# EAGLE design attiny_breakout_ISP6 (EAGLE 6.5.0)
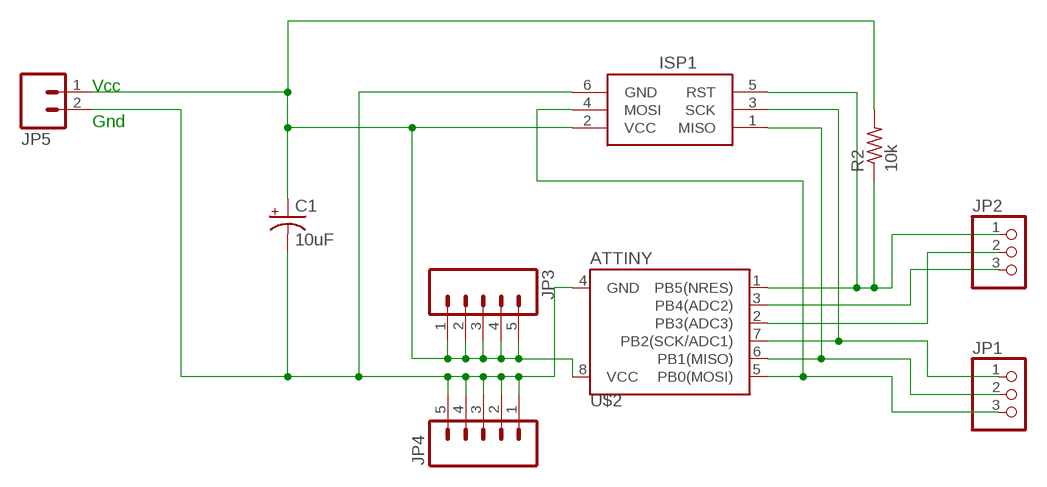
[diagram p0: schematic, sheet 1]

## Parts
C1  10uF  CAP_POLPTH2  [CPOL-RADIAL-10UF-25V]
ISP1  AVRISP-6  [AVRISP]
JP1  PINHD-1X3  [1X03]
JP2  PINHD-1X3  [1X03]
JP3  M05PTH  [1X05]
JP4  M05PTH  [1X05]
JP5  M02PTH  [1X02]
R2  10k  R-US_0207/12  [0207/12]
U$2  ATTINY  ATTINY13DIP  [DIP08]

## Nets
N$1: ISP1.4(MOSI) JP1.3 U$2.5(PB0(MOSI))
N$2: ISP1.1(MISO) JP1.2 U$2.6(PB1(MISO))
N$3: ISP1.5(RST) JP2.1 R2.1 U$2.1(PB5(NRES))
N$4: ISP1.3(SCK) JP1.1 U$2.7(PB2(SCK/ADC1))
N$5: JP2.2 U$2.2(PB3(ADC3))
N$6: JP2.3 U$2.3(PB4(ADC2))
N$7: C1.2(-) ISP1.6(GND) JP4.1 JP4.2 JP4.3 JP4.4 JP4.5 JP5.2 U$2.4(GND)
N$9: C1.1(+) ISP1.2(VCC) JP3.1 JP3.2 JP3.3 JP3.4 JP3.5 JP5.1 R2.2 U$2.8(VCC)

## Notes on the sheet
- Vcc
- Gnd

## Library data of the parts
C1 = SparkFun-Capacitors:CAP_POL: Capacitor Polarized These are standard SMD and PTH capacitors. Normally 10uF, 47uF, and 100uF in electrolytic and tantalum varieties. Always verify the external diameter of the through hole cap, it varies with capacity, voltage, and manufacturer. The EIA devices should be standard.
ISP1 = adafruit:AVRISP: AVR ISP HEADER Standard 6 pin header for AVR programming
JP1 JP2 = adafruit:PINHD-1X3: PIN HEADER
JP3 JP4 = SparkFun-Connectors:M05: Header 5 Standard 5-pin 0.1" header. Use with straight break away headers (SKU : PRT-00116), right angle break away headers (PRT-00553), swiss pins (PRT-00743), machine pins (PRT-00117), and female headers (PRT-00115). Molex polarized connector foot print use with SKU : PRT-08230 with associated crimp pins and housings.
JP5 = SparkFun-Connectors:M02: Standard 2-pin 0.1" header. Use with - straight break away headers ( PRT-00116) - right angle break away headers (PRT-00553) - swiss pins (PRT-00743) - machine pins (PRT-00117) - female headers (PRT-00115) Molex polarized connector foot print use with: PRT-08233 with associated crimp pins and housings. 2.54_SCREWTERM for use with PRT-10571. 3.5mm Screw Terminal footprints for PRT-08084 5mm Screw Terminal footprints for use with PRT-08433
R2 = adafruit:R-US_: RESISTOR, American symbol
U$2 = SparkFun-DigitalIC:ATTINY13: Atmel 8-pin 1kB flash uC

## Board
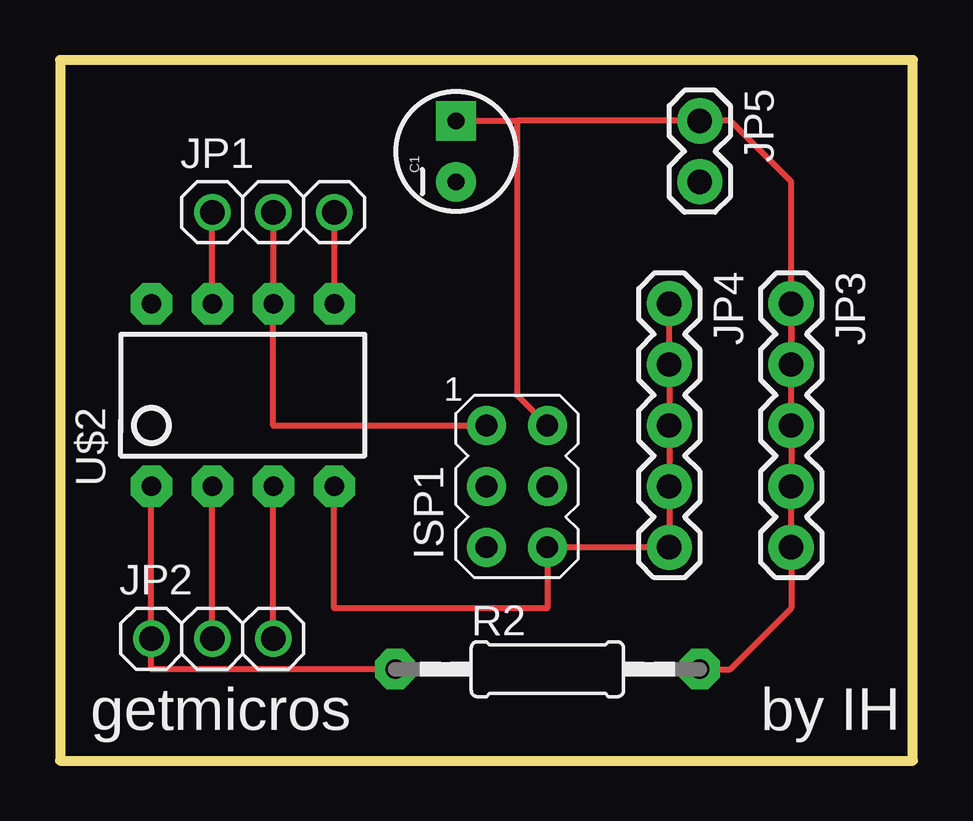
[diagram p1: board, top side]
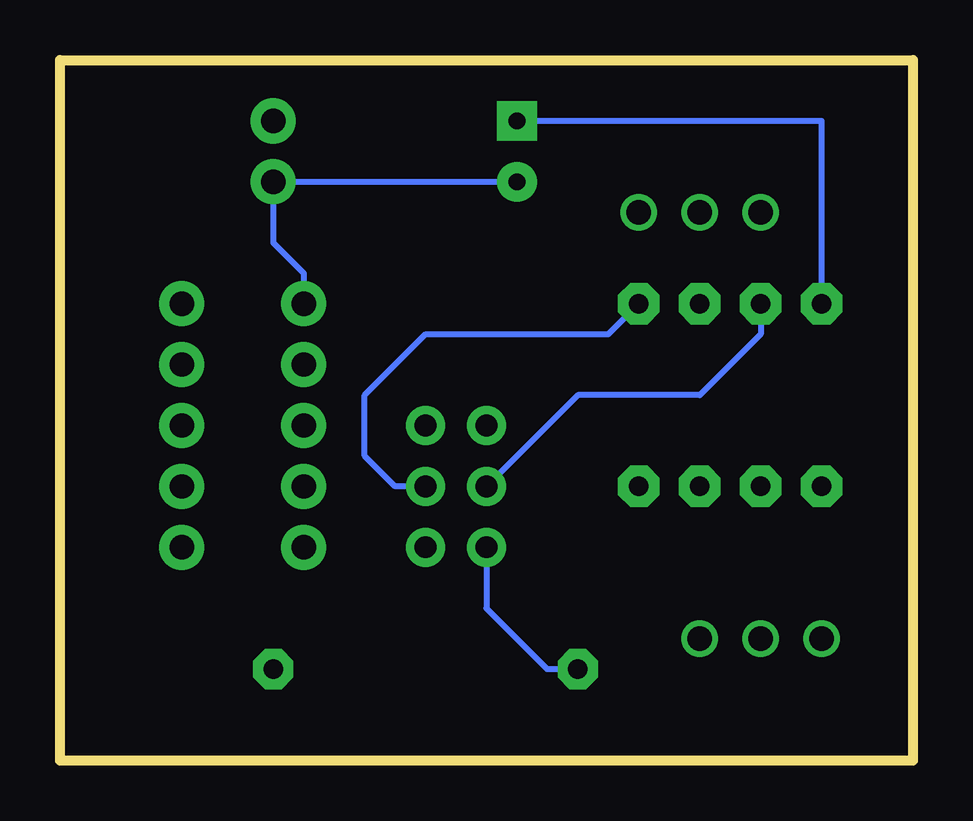
[diagram p2: board, bottom side, seen from below]

Size 35.56 x 29.21 mm. Coordinates in mm from the lower left corner, seen from the top.
Outline: 0,29.21 0,0 35.56,0 35.56,29.21 0,29.21
Copper layers (1*16): Top 0.0356mm / dielectric 1.5011mm / Bottom 0.0356mm
Design rules "LaenPCBOrder": minimum track width 6mil, minimum drill 13mil, track to track 6mil, track to pad 6mil, pad to pad 6mil, via to via 6mil, smd to smd 6mil, copper to edge 15mil, drill to drill 6mil, minimum pad ring 7mil, minimum via ring 7mil, stop-mask expansion 4mil, vias tented up to drill 0mil, thermal gap 10mil

### Footprints (pad centres in the part's own frame; a part is rotated, then mirrored left to right if it is on the bottom)
CPOL-RADIAL-10UF-25V = drill 0.7 pad 1.651 square: 1 1.27,0 | drill 0.7 pad 1.651: 2 -1.27,0
AVRISP = drill 0.9 pad 1.626: 1 -1.27,2.54; 2 1.27,2.54; 3 -1.27,0; 4 1.27,0; 5 -1.27,-2.54; 6 1.27,-2.54
1X03 = drill 1.016: 1 -2.54,0; 2 0,0; 3 2.54,0
1X05 = drill 1.016 pad 1.88: 1 0,0; 2 2.54,0; 3 5.08,0; 4 7.62,0; 5 10.16,0
1X02 = drill 1.016 pad 1.88: 1 0,0; 2 2.54,0
0207/12 = drill 0.813 pad 1.676 octagon: 1 -6.35,0; 2 6.35,0
DIP08 = drill 0.813 pad 1.727 octagon: 1 -3.81,-3.81; 2 -1.27,-3.81; 3 1.27,-3.81; 4 3.81,-3.81; 5 3.81,3.81; 6 1.27,3.81; 7 -1.27,3.81; 8 -3.81,3.81

### Placement (x,y rotation side)
C1  16.51,25.4 90 top
ISP1  19.05,11.43 0 top
JP1  8.89,22.86 0 top
JP2  6.35,5.08 0 top
JP3  30.48,19.05 270 top
JP4  25.4,19.05 270 top
JP5  26.67,26.67 270 top
R2  20.32,3.81 0 top
U$2  7.62,15.24 0 top

### Tracks (layer width: path | path; a pad name or v marks a point on that pad's centre or on a via)
N$1
  Top 0.254: JP1.3 U$2.5
  Bottom 0.254: ISP1.4 21.59,11.43 22.86,12.7 22.86,15.24 20.32,17.78 12.7,17.78 U$2.5
N$2
  Top 0.254: ISP1.1 8.89,13.97 U$2.6 JP1.2
N$3
  Top 0.254: U$2.1 JP2.1 3.81,3.81 R2.1
  Bottom 0.254: ISP1.5 17.78,6.35 15.24,3.81 R2.1
N$4
  Top 0.254: U$2.7 JP1.1
  Bottom 0.254: ISP1.3 13.97,15.24 8.89,15.24 6.35,17.78 U$2.7
N$5
  Top 0.254: JP2.2 U$2.2
N$6
  Top 0.254: JP2.3 U$2.3
N$7
  Top 0.254: JP4.1 JP4.2 JP4.3 JP4.4 JP4.5 ISP1.6 20.32,6.35 11.43,6.35 U$2.4
  Bottom 0.254: C1.2 JP5.2 26.67,21.59 25.4,20.32 JP4.1
N$9
  Top 0.254: JP3.1 JP3.2 | JP3.2 JP3.3 JP3.4 JP3.5 30.48,6.35 27.94,3.81 R2.2 | C1.1 19.05,26.67 | ISP1.2 19.05,15.24 19.05,26.67 | JP3.2 30.48,24.13 27.94,26.67 JP5.1 19.05,26.67
  Bottom 0.254: C1.1 3.81,26.67 U$2.8

### Text on the board
tPlace: getmicros | by IH